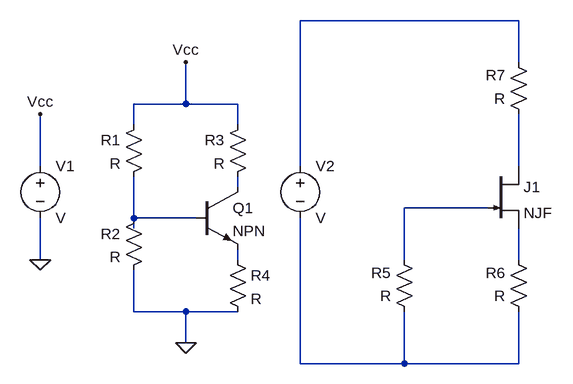
[diagram p0: schematic Punkt_pracy.asc]
Punkt_pracy.asc, the LTspice schematic file:
Version 4
SHEET 1 880 680
WIRE 736 -112 400 -112
WIRE 736 -48 736 -112
WIRE 224 16 224 -48
WIRE 224 16 144 16
WIRE 304 16 224 16
WIRE 144 48 144 16
WIRE 304 48 304 16
WIRE 0 112 0 32
WIRE 400 112 400 -112
WIRE 736 112 736 32
WIRE 304 144 304 128
WIRE 688 176 560 176
WIRE 144 192 144 128
WIRE 240 192 144 192
WIRE 144 208 144 192
WIRE 0 256 0 192
WIRE 304 256 304 240
WIRE 560 256 560 176
WIRE 736 256 736 208
WIRE 144 336 144 272
WIRE 224 336 144 336
WIRE 304 336 224 336
WIRE 224 384 224 336
WIRE 400 416 400 192
WIRE 560 416 560 336
WIRE 560 416 400 416
WIRE 736 416 736 336
WIRE 736 416 560 416
FLAG 224 384 0
FLAG 0 256 0
FLAG 0 32 Vcc
FLAG 224 -48 Vcc
SYMBOL res 160 32 M0
SYMATTR InstName R1
SYMBOL res 160 176 M0
SYMATTR InstName R2
SYMBOL res 320 32 M0
SYMATTR InstName R3
SYMBOL res 288 240 R0
SYMATTR InstName R4
SYMBOL voltage 0 96 R0
SYMATTR InstName V1
SYMBOL npn 240 144 R0
SYMATTR InstName Q1
SYMBOL njf 688 112 R0
SYMATTR InstName J1
SYMBOL res 576 352 R180
WINDOW 0 36 76 Left 2
WINDOW 3 36 40 Left 2
SYMATTR InstName R5
SYMBOL res 752 352 R180
WINDOW 0 36 76 Left 2
WINDOW 3 36 40 Left 2
SYMATTR InstName R6
SYMBOL res 752 48 R180
WINDOW 0 36 76 Left 2
WINDOW 3 36 40 Left 2
SYMATTR InstName R7
SYMBOL voltage 400 96 R0
SYMATTR InstName V2

The netlist it stands for:
* Punkt_pracy.asc
R1 Vcc N005 R
R2 N005 0 R
R3 Vcc N003 R
R4 N006 0 R
V1 Vcc 0 V
Q1 N003 N005 N006 0 NPN
J1 N002 N004 N007 NJF
R5 N008 N004 R
R6 N008 N007 R
R7 N002 N001 R
V2 N001 N008 V
.model NPN NPN
.model PNP PNP
.lib standard.bjt
.model NJF NJF
.model PJF PJF
.lib standard.jft
.backanno
.end